# EAGLE schematic I2CHubLogicLevel (EAGLE 8.4.0)
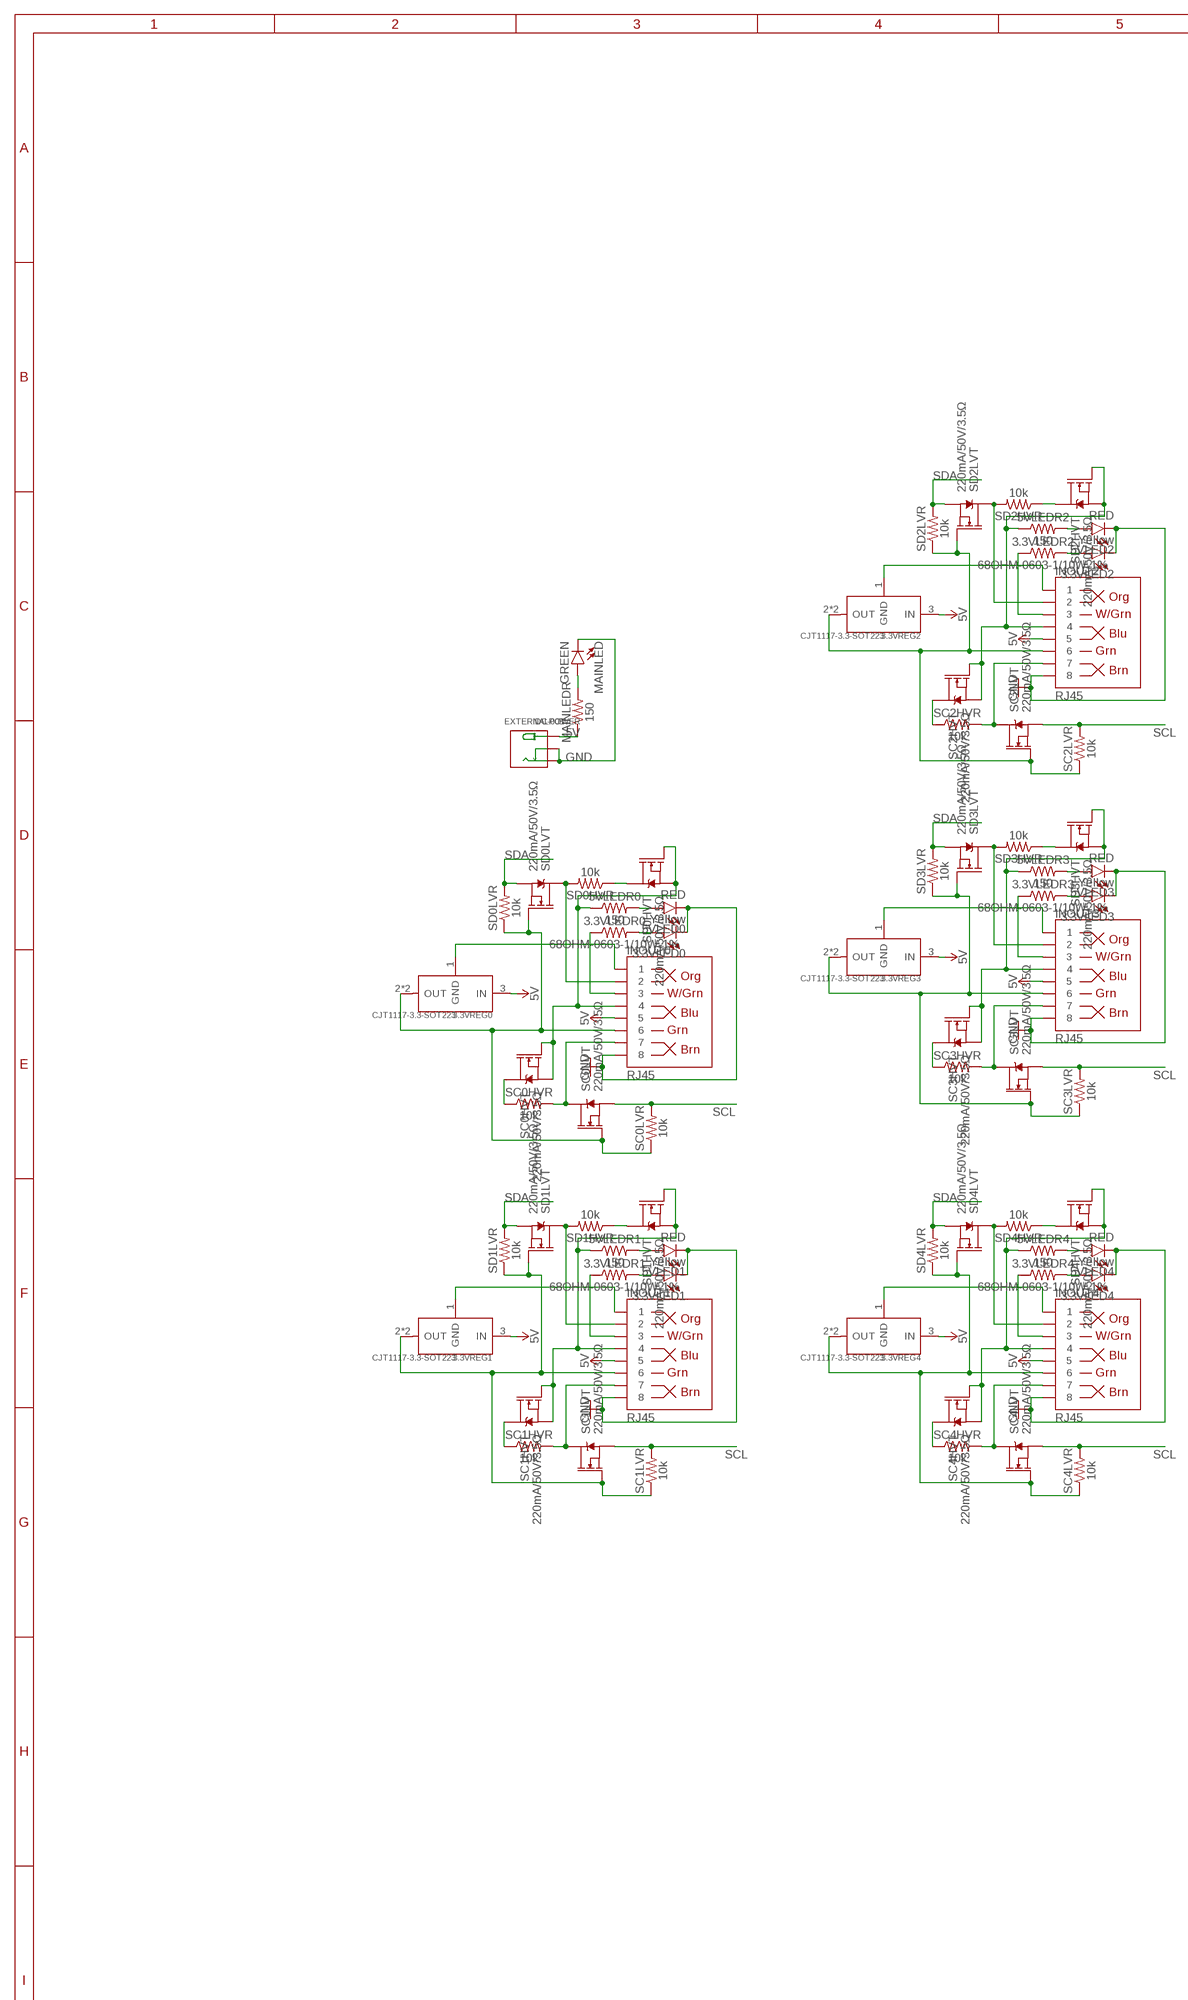
[diagram p0: schematic, sheet 1, part 1 of 2]
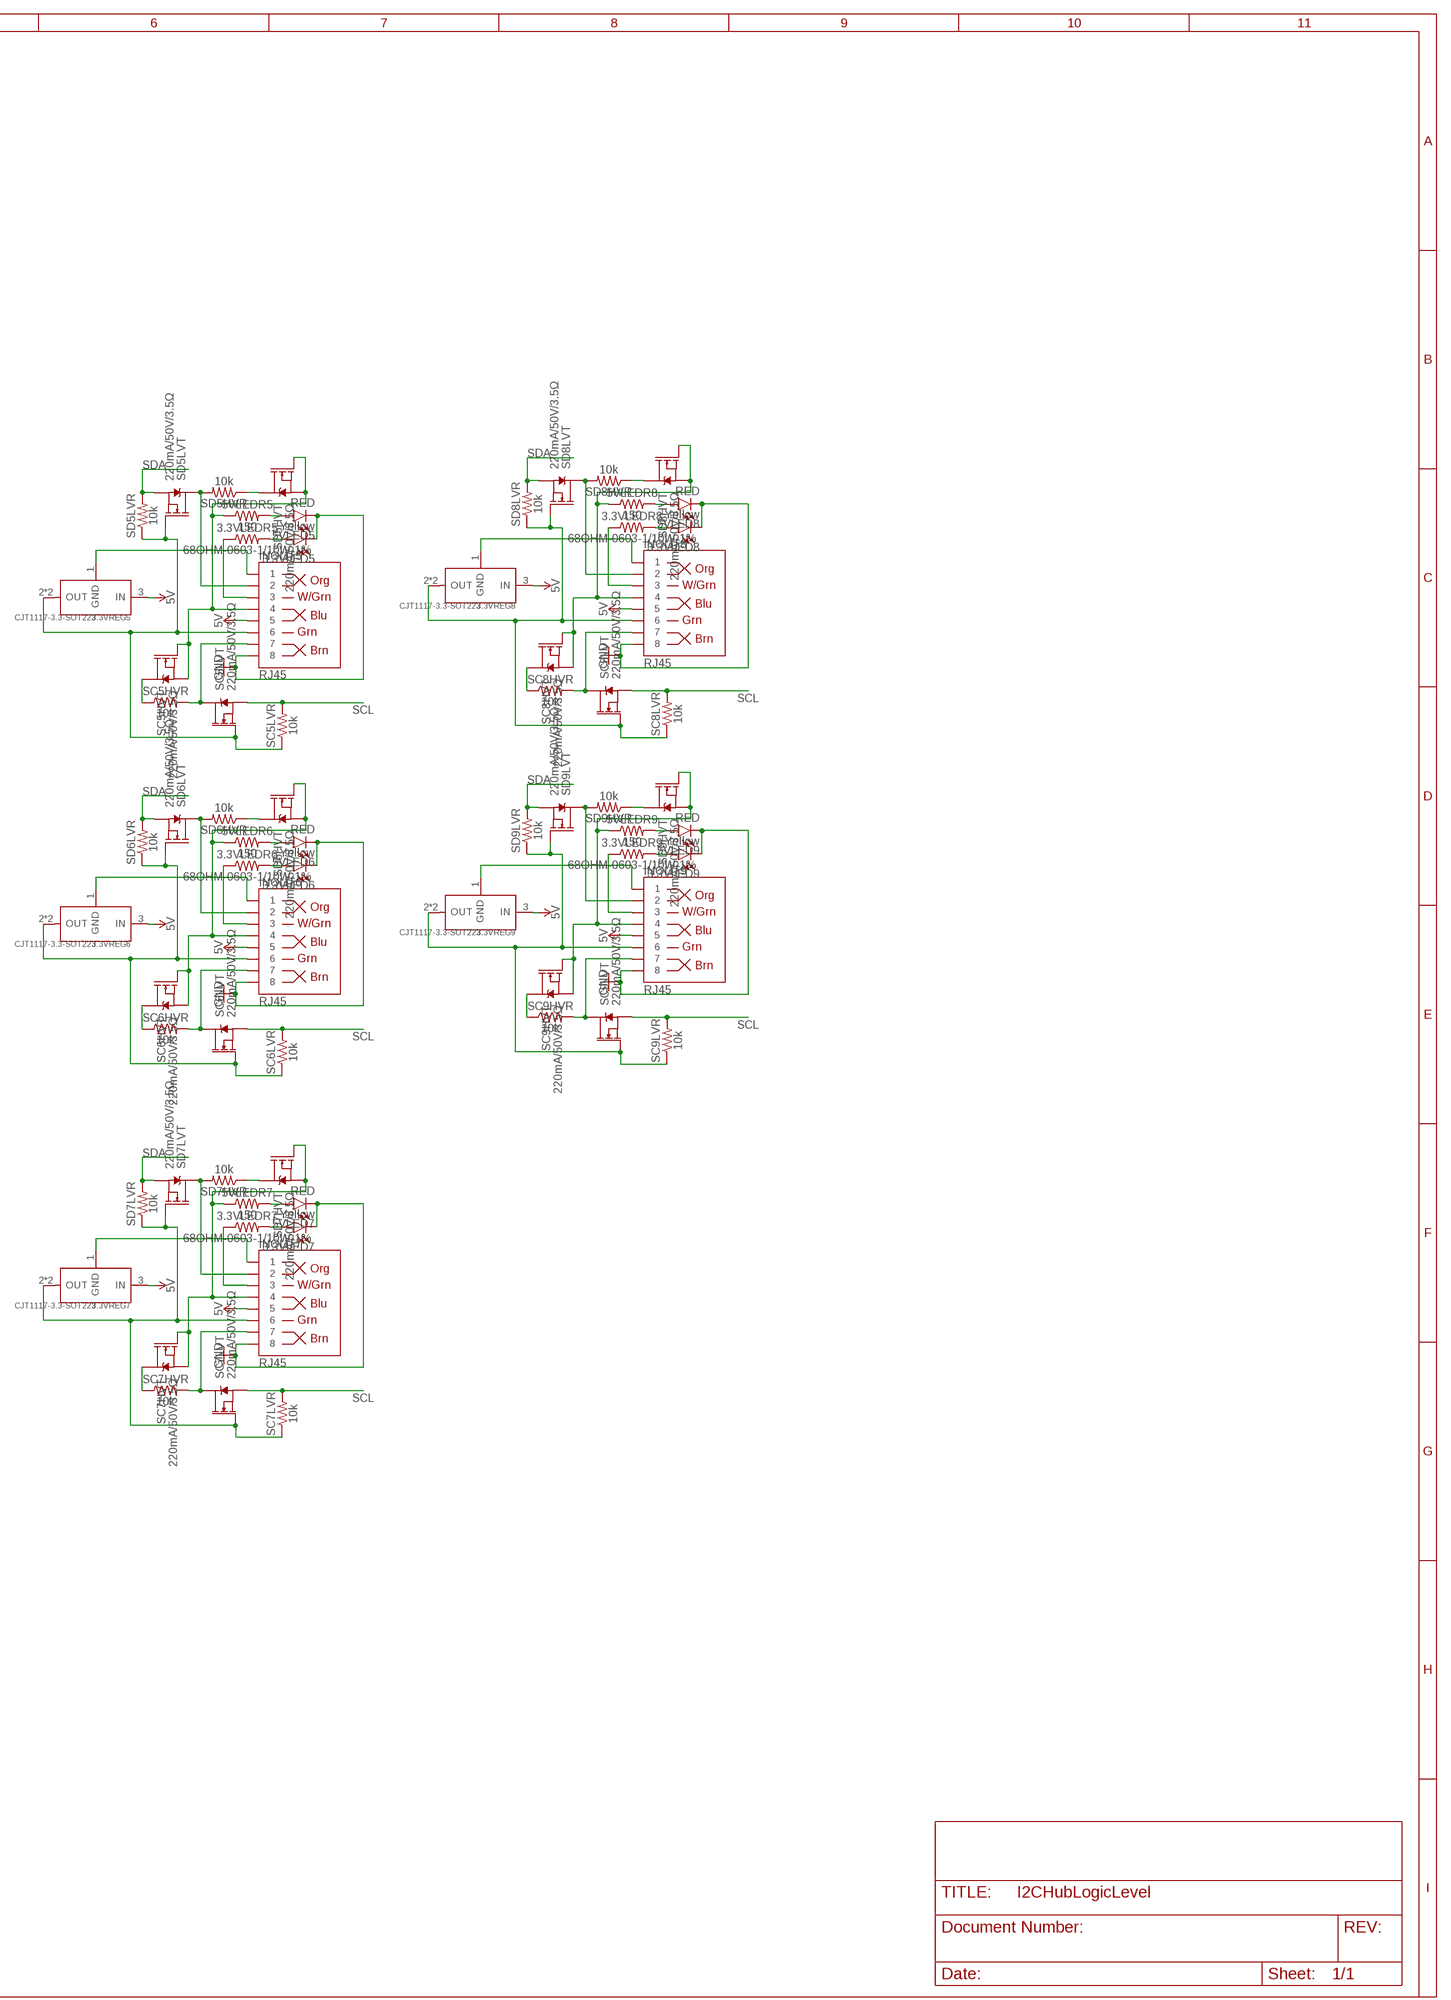
[diagram p1: schematic, sheet 1, part 2 of 2]

## Parts
3.3VLED0  Yellow  LED-YELLOW0603  [LED-0603]
3.3VLED1  Yellow  LED-YELLOW0603  [LED-0603]
3.3VLED2  Yellow  LED-YELLOW0603  [LED-0603]
3.3VLED3  Yellow  LED-YELLOW0603  [LED-0603]
3.3VLED4  Yellow  LED-YELLOW0603  [LED-0603]
3.3VLED5  Yellow  LED-YELLOW0603  [LED-0603]
3.3VLED6  Yellow  LED-YELLOW0603  [LED-0603]
3.3VLED7  Yellow  LED-YELLOW0603  [LED-0603]
3.3VLED8  Yellow  LED-YELLOW0603  [LED-0603]
3.3VLED9  Yellow  LED-YELLOW0603  [LED-0603]
3.3VLEDR0  68OHM-0603-1/10W-1%  [0603]
3.3VLEDR1  68OHM-0603-1/10W-1%  [0603]
3.3VLEDR2  68OHM-0603-1/10W-1%  [0603]
3.3VLEDR3  68OHM-0603-1/10W-1%  [0603]
3.3VLEDR4  68OHM-0603-1/10W-1%  [0603]
3.3VLEDR5  68OHM-0603-1/10W-1%  [0603]
3.3VLEDR6  68OHM-0603-1/10W-1%  [0603]
3.3VLEDR7  68OHM-0603-1/10W-1%  [0603]
3.3VLEDR8  68OHM-0603-1/10W-1%  [0603]
3.3VLEDR9  68OHM-0603-1/10W-1%  [0603]
3.3VREG0  CJT1117-3.3-SOT223  PMIC-CJT1117-3.3(SOT223)  [SOT-223]
3.3VREG1  CJT1117-3.3-SOT223  PMIC-CJT1117-3.3(SOT223)  [SOT-223]
3.3VREG2  CJT1117-3.3-SOT223  PMIC-CJT1117-3.3(SOT223)  [SOT-223]
3.3VREG3  CJT1117-3.3-SOT223  PMIC-CJT1117-3.3(SOT223)  [SOT-223]
3.3VREG4  CJT1117-3.3-SOT223  PMIC-CJT1117-3.3(SOT223)  [SOT-223]
3.3VREG5  CJT1117-3.3-SOT223  PMIC-CJT1117-3.3(SOT223)  [SOT-223]
3.3VREG6  CJT1117-3.3-SOT223  PMIC-CJT1117-3.3(SOT223)  [SOT-223]
3.3VREG7  CJT1117-3.3-SOT223  PMIC-CJT1117-3.3(SOT223)  [SOT-223]
3.3VREG8  CJT1117-3.3-SOT223  PMIC-CJT1117-3.3(SOT223)  [SOT-223]
3.3VREG9  CJT1117-3.3-SOT223  PMIC-CJT1117-3.3(SOT223)  [SOT-223]
5VLED0  RED  LED-RED0603  [LED-0603]
5VLED1  RED  LED-RED0603  [LED-0603]
5VLED2  RED  LED-RED0603  [LED-0603]
5VLED3  RED  LED-RED0603  [LED-0603]
5VLED4  RED  LED-RED0603  [LED-0603]
5VLED5  RED  LED-RED0603  [LED-0603]
5VLED6  RED  LED-RED0603  [LED-0603]
5VLED7  RED  LED-RED0603  [LED-0603]
5VLED8  RED  LED-RED0603  [LED-0603]
5VLED9  RED  LED-RED0603  [LED-0603]
5VLEDR0  150  150OHM-0603-1/10W-1%  [0603]
5VLEDR1  150  150OHM-0603-1/10W-1%  [0603]
5VLEDR2  150  150OHM-0603-1/10W-1%  [0603]
5VLEDR3  150  150OHM-0603-1/10W-1%  [0603]
5VLEDR4  150  150OHM-0603-1/10W-1%  [0603]
5VLEDR5  150  150OHM-0603-1/10W-1%  [0603]
5VLEDR6  150  150OHM-0603-1/10W-1%  [0603]
5VLEDR7  150  150OHM-0603-1/10W-1%  [0603]
5VLEDR8  150  150OHM-0603-1/10W-1%  [0603]
5VLEDR9  150  150OHM-0603-1/10W-1%  [0603]
EXTERNALPOWER  DC-005  CONN-POWER-JACK-2.1MM(DC-005)  [DCJ3P-14.2X11.0X9.0MM]
INOUT0  RJ45  RJ45-8  [RJ45-8]
INOUT1  RJ45  RJ45-8  [RJ45-8]
INOUT2  RJ45  RJ45-8  [RJ45-8]
INOUT3  RJ45  RJ45-8  [RJ45-8]
INOUT4  RJ45  RJ45-8  [RJ45-8]
INOUT5  RJ45  RJ45-8  [RJ45-8]
INOUT6  RJ45  RJ45-8  [RJ45-8]
INOUT7  RJ45  RJ45-8  [RJ45-8]
INOUT8  RJ45  RJ45-8  [RJ45-8]
INOUT9  RJ45  RJ45-8  [RJ45-8]
MAINLED  GREEN  LED-GREEN0603  [LED-0603]
MAINLEDR  150  150OHM-0603-1/10W-1%  [0603]
SC0HVR  10k  10KOHM-0603-1/10W-1%  [0603]
SC0HVT  220mA/50V/3.5Ω  MOSFET-NCH-BSS138  [SOT23-3]
SC0LVR  10k  10KOHM-0603-1/10W-1%  [0603]
SC0LVT  220mA/50V/3.5Ω  MOSFET-NCH-BSS138  [SOT23-3]
SC1HVR  10k  10KOHM-0603-1/10W-1%  [0603]
SC1HVT  220mA/50V/3.5Ω  MOSFET-NCH-BSS138  [SOT23-3]
SC1LVR  10k  10KOHM-0603-1/10W-1%  [0603]
SC1LVT  220mA/50V/3.5Ω  MOSFET-NCH-BSS138  [SOT23-3]
SC2HVR  10k  10KOHM-0603-1/10W-1%  [0603]
SC2HVT  220mA/50V/3.5Ω  MOSFET-NCH-BSS138  [SOT23-3]
SC2LVR  10k  10KOHM-0603-1/10W-1%  [0603]
SC2LVT  220mA/50V/3.5Ω  MOSFET-NCH-BSS138  [SOT23-3]
SC3HVR  10k  10KOHM-0603-1/10W-1%  [0603]
SC3HVT  220mA/50V/3.5Ω  MOSFET-NCH-BSS138  [SOT23-3]
SC3LVR  10k  10KOHM-0603-1/10W-1%  [0603]
SC3LVT  220mA/50V/3.5Ω  MOSFET-NCH-BSS138  [SOT23-3]
SC4HVR  10k  10KOHM-0603-1/10W-1%  [0603]
SC4HVT  220mA/50V/3.5Ω  MOSFET-NCH-BSS138  [SOT23-3]
SC4LVR  10k  10KOHM-0603-1/10W-1%  [0603]
SC4LVT  220mA/50V/3.5Ω  MOSFET-NCH-BSS138  [SOT23-3]
SC5HVR  10k  10KOHM-0603-1/10W-1%  [0603]
SC5HVT  220mA/50V/3.5Ω  MOSFET-NCH-BSS138  [SOT23-3]
SC5LVR  10k  10KOHM-0603-1/10W-1%  [0603]
SC5LVT  220mA/50V/3.5Ω  MOSFET-NCH-BSS138  [SOT23-3]
SC6HVR  10k  10KOHM-0603-1/10W-1%  [0603]
SC6HVT  220mA/50V/3.5Ω  MOSFET-NCH-BSS138  [SOT23-3]
SC6LVR  10k  10KOHM-0603-1/10W-1%  [0603]
SC6LVT  220mA/50V/3.5Ω  MOSFET-NCH-BSS138  [SOT23-3]
SC7HVR  10k  10KOHM-0603-1/10W-1%  [0603]
SC7HVT  220mA/50V/3.5Ω  MOSFET-NCH-BSS138  [SOT23-3]
SC7LVR  10k  10KOHM-0603-1/10W-1%  [0603]
SC7LVT  220mA/50V/3.5Ω  MOSFET-NCH-BSS138  [SOT23-3]
SC8HVR  10k  10KOHM-0603-1/10W-1%  [0603]
SC8HVT  220mA/50V/3.5Ω  MOSFET-NCH-BSS138  [SOT23-3]
SC8LVR  10k  10KOHM-0603-1/10W-1%  [0603]
SC8LVT  220mA/50V/3.5Ω  MOSFET-NCH-BSS138  [SOT23-3]
SC9HVR  10k  10KOHM-0603-1/10W-1%  [0603]
SC9HVT  220mA/50V/3.5Ω  MOSFET-NCH-BSS138  [SOT23-3]
SC9LVR  10k  10KOHM-0603-1/10W-1%  [0603]
SC9LVT  220mA/50V/3.5Ω  MOSFET-NCH-BSS138  [SOT23-3]
SD0HVR  10k  10KOHM-0603-1/10W-1%  [0603]
SD0HVT  220mA/50V/3.5Ω  MOSFET-NCH-BSS138  [SOT23-3]
SD0LVR  10k  10KOHM-0603-1/10W-1%  [0603]
SD0LVT  220mA/50V/3.5Ω  MOSFET-NCH-BSS138  [SOT23-3]
SD1HVR  10k  10KOHM-0603-1/10W-1%  [0603]
SD1HVT  220mA/50V/3.5Ω  MOSFET-NCH-BSS138  [SOT23-3]
SD1LVR  10k  10KOHM-0603-1/10W-1%  [0603]
SD1LVT  220mA/50V/3.5Ω  MOSFET-NCH-BSS138  [SOT23-3]
SD2HVR  10k  10KOHM-0603-1/10W-1%  [0603]
SD2HVT  220mA/50V/3.5Ω  MOSFET-NCH-BSS138  [SOT23-3]
SD2LVR  10k  10KOHM-0603-1/10W-1%  [0603]
SD2LVT  220mA/50V/3.5Ω  MOSFET-NCH-BSS138  [SOT23-3]
SD3HVR  10k  10KOHM-0603-1/10W-1%  [0603]
SD3HVT  220mA/50V/3.5Ω  MOSFET-NCH-BSS138  [SOT23-3]
SD3LVR  10k  10KOHM-0603-1/10W-1%  [0603]
SD3LVT  220mA/50V/3.5Ω  MOSFET-NCH-BSS138  [SOT23-3]
SD4HVR  10k  10KOHM-0603-1/10W-1%  [0603]
SD4HVT  220mA/50V/3.5Ω  MOSFET-NCH-BSS138  [SOT23-3]
SD4LVR  10k  10KOHM-0603-1/10W-1%  [0603]
SD4LVT  220mA/50V/3.5Ω  MOSFET-NCH-BSS138  [SOT23-3]
SD5HVR  10k  10KOHM-0603-1/10W-1%  [0603]
SD5HVT  220mA/50V/3.5Ω  MOSFET-NCH-BSS138  [SOT23-3]
SD5LVR  10k  10KOHM-0603-1/10W-1%  [0603]
SD5LVT  220mA/50V/3.5Ω  MOSFET-NCH-BSS138  [SOT23-3]
SD6HVR  10k  10KOHM-0603-1/10W-1%  [0603]
SD6HVT  220mA/50V/3.5Ω  MOSFET-NCH-BSS138  [SOT23-3]
SD6LVR  10k  10KOHM-0603-1/10W-1%  [0603]
SD6LVT  220mA/50V/3.5Ω  MOSFET-NCH-BSS138  [SOT23-3]
SD7HVR  10k  10KOHM-0603-1/10W-1%  [0603]
SD7HVT  220mA/50V/3.5Ω  MOSFET-NCH-BSS138  [SOT23-3]
SD7LVR  10k  10KOHM-0603-1/10W-1%  [0603]
SD7LVT  220mA/50V/3.5Ω  MOSFET-NCH-BSS138  [SOT23-3]
SD8HVR  10k  10KOHM-0603-1/10W-1%  [0603]
SD8HVT  220mA/50V/3.5Ω  MOSFET-NCH-BSS138  [SOT23-3]
SD8LVR  10k  10KOHM-0603-1/10W-1%  [0603]
SD8LVT  220mA/50V/3.5Ω  MOSFET-NCH-BSS138  [SOT23-3]
SD9HVR  10k  10KOHM-0603-1/10W-1%  [0603]
SD9HVT  220mA/50V/3.5Ω  MOSFET-NCH-BSS138  [SOT23-3]
SD9LVR  10k  10KOHM-0603-1/10W-1%  [0603]
SD9LVT  220mA/50V/3.5Ω  MOSFET-NCH-BSS138  [SOT23-3]

## Nets
3.3CC0: 3.3VLEDR0.1 INOUT0.3
3.3CC1: 3.3VLEDR1.1 INOUT1.3
3.3CC2: 3.3VLEDR2.1 INOUT2.3
3.3CC3: 3.3VLEDR3.1 INOUT3.3
3.3CC4: 3.3VLEDR4.1 INOUT4.3
3.3CC5: 3.3VLEDR5.1 INOUT5.3
3.3CC6: 3.3VLEDR6.1 INOUT6.3
3.3CC7: 3.3VLEDR7.1 INOUT7.3
3.3CC8: 3.3VLEDR8.1 INOUT8.3
3.3CC9: 3.3VLEDR9.1 INOUT9.3
3.3LED0: 3.3VLED0.A 3.3VLEDR0.2
3.3LED1: 3.3VLED1.A 3.3VLEDR1.2
3.3LED2: 3.3VLED2.A 3.3VLEDR2.2
3.3LED3: 3.3VLED3.A 3.3VLEDR3.2
3.3LED4: 3.3VLED4.A 3.3VLEDR4.2
3.3LED5: 3.3VLED5.A 3.3VLEDR5.2
3.3LED6: 3.3VLED6.A 3.3VLEDR6.2
3.3LED7: 3.3VLED7.A 3.3VLEDR7.2
3.3LED8: 3.3VLED8.A 3.3VLEDR8.2
3.3LED9: 3.3VLED9.A 3.3VLEDR9.2
3.3V0: 3.3VREG0.2(OUT) 3.3VREG0.TER(OUT) INOUT0.6 SC0LVR.1 SC0LVT.1(G) SD0LVR.1 SD0LVT.1(G)
3.3V1: 3.3VREG1.2(OUT) 3.3VREG1.TER(OUT) INOUT1.6 SC1LVR.1 SC1LVT.1(G) SD1LVR.1 SD1LVT.1(G)
3.3V2: 3.3VREG2.2(OUT) 3.3VREG2.TER(OUT) INOUT2.6 SC2LVR.1 SC2LVT.1(G) SD2LVR.1 SD2LVT.1(G)
3.3V3: 3.3VREG3.2(OUT) 3.3VREG3.TER(OUT) INOUT3.6 SC3LVR.1 SC3LVT.1(G) SD3LVR.1 SD3LVT.1(G)
3.3V4: 3.3VREG4.2(OUT) 3.3VREG4.TER(OUT) INOUT4.6 SC4LVR.1 SC4LVT.1(G) SD4LVR.1 SD4LVT.1(G)
3.3V5: 3.3VREG5.2(OUT) 3.3VREG5.TER(OUT) INOUT5.6 SC5LVR.1 SC5LVT.1(G) SD5LVR.1 SD5LVT.1(G)
3.3V6: 3.3VREG6.2(OUT) 3.3VREG6.TER(OUT) INOUT6.6 SC6LVR.1 SC6LVT.1(G) SD6LVR.1 SD6LVT.1(G)
3.3V7: 3.3VREG7.2(OUT) 3.3VREG7.TER(OUT) INOUT7.6 SC7LVR.1 SC7LVT.1(G) SD7LVR.1 SD7LVT.1(G)
3.3V8: 3.3VREG8.2(OUT) 3.3VREG8.TER(OUT) INOUT8.6 SC8LVR.1 SC8LVT.1(G) SD8LVR.1 SD8LVT.1(G)
3.3V9: 3.3VREG9.2(OUT) 3.3VREG9.TER(OUT) INOUT9.6 SC9LVR.1 SC9LVT.1(G) SD9LVR.1 SD9LVT.1(G)
5V: 3.3VREG0.3(IN) 3.3VREG1.3(IN) 3.3VREG2.3(IN) 3.3VREG3.3(IN) 3.3VREG4.3(IN) 3.3VREG5.3(IN) 3.3VREG6.3(IN) 3.3VREG7.3(IN) 3.3VREG8.3(IN) 3.3VREG9.3(IN) EXTERNALPOWER.+ INOUT0.5 INOUT1.5 INOUT2.5 INOUT3.5 INOUT4.5 INOUT5.5 INOUT6.5 INOUT7.5 INOUT8.5 INOUT9.5 MAINLEDR.1
5VCC0: 5VLEDR0.1 INOUT0.4 SC0HVT.1(G) SC0HVT.2(S) SD0HVT.1(G) SD0HVT.2(S)
5VCC1: 5VLEDR1.1 INOUT1.4 SC1HVT.1(G) SC1HVT.2(S) SD1HVT.1(G) SD1HVT.2(S)
5VCC2: 5VLEDR2.1 INOUT2.4 SC2HVT.1(G) SC2HVT.2(S) SD2HVT.1(G) SD2HVT.2(S)
5VCC3: 5VLEDR3.1 INOUT3.4 SC3HVT.1(G) SC3HVT.2(S) SD3HVT.1(G) SD3HVT.2(S)
5VCC4: 5VLEDR4.1 INOUT4.4 SC4HVT.1(G) SC4HVT.2(S) SD4HVT.1(G) SD4HVT.2(S)
5VCC5: 5VLEDR5.1 INOUT5.4 SC5HVT.1(G) SC5HVT.2(S) SD5HVT.1(G) SD5HVT.2(S)
5VCC6: 5VLEDR6.1 INOUT6.4 SC6HVT.1(G) SC6HVT.2(S) SD6HVT.1(G) SD6HVT.2(S)
5VCC7: 5VLEDR7.1 INOUT7.4 SC7HVT.1(G) SC7HVT.2(S) SD7HVT.1(G) SD7HVT.2(S)
5VCC8: 5VLEDR8.1 INOUT8.4 SC8HVT.1(G) SC8HVT.2(S) SD8HVT.1(G) SD8HVT.2(S)
5VCC9: 5VLEDR9.1 INOUT9.4 SC9HVT.1(G) SC9HVT.2(S) SD9HVT.1(G) SD9HVT.2(S)
5VLED0: 5VLED0.A 5VLEDR0.2
5VLED1: 5VLED1.A 5VLEDR1.2
5VLED2: 5VLED2.A 5VLEDR2.2
5VLED3: 5VLED3.A 5VLEDR3.2
5VLED4: 5VLED4.A 5VLEDR4.2
5VLED5: 5VLED5.A 5VLEDR5.2
5VLED6: 5VLED6.A 5VLEDR6.2
5VLED7: 5VLED7.A 5VLEDR7.2
5VLED8: 5VLED8.A 5VLEDR8.2
5VLED9: 5VLED9.A 5VLEDR9.2
GND: 3.3VLED0.C 3.3VLED1.C 3.3VLED2.C 3.3VLED3.C 3.3VLED4.C 3.3VLED5.C 3.3VLED6.C 3.3VLED7.C 3.3VLED8.C 3.3VLED9.C 5VLED0.C 5VLED1.C 5VLED2.C 5VLED3.C 5VLED4.C 5VLED5.C 5VLED6.C 5VLED7.C 5VLED8.C 5VLED9.C EXTERNALPOWER.-1(-) EXTERNALPOWER.-2(CDN) INOUT0.8 INOUT1.8 INOUT2.8 INOUT3.8 INOUT4.8 INOUT5.8 INOUT6.8 INOUT7.8 INOUT8.8 INOUT9.8 MAINLED.C
GNDCC0: 3.3VREG0.1(GND) INOUT0.1
GNDCC1: 3.3VREG1.1(GND) INOUT1.1
GNDCC2: 3.3VREG2.1(GND) INOUT2.1
GNDCC3: 3.3VREG3.1(GND) INOUT3.1
GNDCC4: 3.3VREG4.1(GND) INOUT4.1
GNDCC5: 3.3VREG5.1(GND) INOUT5.1
GNDCC6: 3.3VREG6.1(GND) INOUT6.1
GNDCC7: 3.3VREG7.1(GND) INOUT7.1
GNDCC8: 3.3VREG8.1(GND) INOUT8.1
GNDCC9: 3.3VREG9.1(GND) INOUT9.1
MAINLED: MAINLED.A MAINLEDR.2
SC0: INOUT0.7 SC0HVR.2 SC0LVT.3(D)
SC1: INOUT1.7 SC1HVR.2 SC1LVT.3(D)
SC2: INOUT2.7 SC2HVR.2 SC2LVT.3(D)
SC3: INOUT3.7 SC3HVR.2 SC3LVT.3(D)
SC4: INOUT4.7 SC4HVR.2 SC4LVT.3(D)
SC5: INOUT5.7 SC5HVR.2 SC5LVT.3(D)
SC6: INOUT6.7 SC6HVR.2 SC6LVT.3(D)
SC7: INOUT7.7 SC7HVR.2 SC7LVT.3(D)
SC8: INOUT8.7 SC8HVR.2 SC8LVT.3(D)
SC9: INOUT9.7 SC9HVR.2 SC9LVT.3(D)
SCHV0: SC0HVR.1 SC0HVT.3(D)
SCHV1: SC1HVR.1 SC1HVT.3(D)
SCHV2: SC2HVR.1 SC2HVT.3(D)
SCHV3: SC3HVR.1 SC3HVT.3(D)
SCHV4: SC4HVR.1 SC4HVT.3(D)
SCHV5: SC5HVR.1 SC5HVT.3(D)
SCHV6: SC6HVR.1 SC6HVT.3(D)
SCHV7: SC7HVR.1 SC7HVT.3(D)
SCHV8: SC8HVR.1 SC8HVT.3(D)
SCHV9: SC9HVR.1 SC9HVT.3(D)
SCL: SC0LVR.2 SC0LVT.2(S) SC1LVR.2 SC1LVT.2(S) SC2LVR.2 SC2LVT.2(S) SC3LVR.2 SC3LVT.2(S) SC4LVR.2 SC4LVT.2(S) SC5LVR.2 SC5LVT.2(S) SC6LVR.2 SC6LVT.2(S) SC7LVR.2 SC7LVT.2(S) SC8LVR.2 SC8LVT.2(S) SC9LVR.2 SC9LVT.2(S)
SD0: INOUT0.2 SD0HVR.2 SD0LVT.3(D)
SD1: INOUT1.2 SD1HVR.2 SD1LVT.3(D)
SD2: INOUT2.2 SD2HVR.2 SD2LVT.3(D)
SD3: INOUT3.2 SD3HVR.2 SD3LVT.3(D)
SD4: INOUT4.2 SD4HVR.2 SD4LVT.3(D)
SD5: INOUT5.2 SD5HVR.2 SD5LVT.3(D)
SD6: INOUT6.2 SD6HVR.2 SD6LVT.3(D)
SD7: INOUT7.2 SD7HVR.2 SD7LVT.3(D)
SD8: INOUT8.2 SD8HVR.2 SD8LVT.3(D)
SD9: INOUT9.2 SD9HVR.2 SD9LVT.3(D)
SDA: SD0LVR.2 SD0LVT.2(S) SD1LVR.2 SD1LVT.2(S) SD2LVR.2 SD2LVT.2(S) SD3LVR.2 SD3LVT.2(S) SD4LVR.2 SD4LVT.2(S) SD5LVR.2 SD5LVT.2(S) SD6LVR.2 SD6LVT.2(S) SD7LVR.2 SD7LVT.2(S) SD8LVR.2 SD8LVT.2(S) SD9LVR.2 SD9LVT.2(S)
SDHV0: SD0HVR.1 SD0HVT.3(D)
SDHV1: SD1HVR.1 SD1HVT.3(D)
SDHV2: SD2HVR.1 SD2HVT.3(D)
SDHV3: SD3HVR.1 SD3HVT.3(D)
SDHV4: SD4HVR.1 SD4HVT.3(D)
SDHV5: SD5HVR.1 SD5HVT.3(D)
SDHV6: SD6HVR.1 SD6HVT.3(D)
SDHV7: SD7HVR.1 SD7HVT.3(D)
SDHV8: SD8HVR.1 SD8HVT.3(D)
SDHV9: SD9HVR.1 SD9HVT.3(D)

## Library data of the parts
3.3VLED0 3.3VLED1-3.3VLED9 = SparkFun-LED:LED-YELLOW: Yellow SMD LED Used in manufacturing several products at SparkFun. Packages: 0603 - SMD 0603 package[Product Link] <http://www.kingbrightusa.com/product.asp?catalog_name=LED&product_id=APT1608SYCK> 0603 -SMART - SMART SMD 0603 package (more efficient/more expensive) [Product Link] <http://www.osram-os.com/osram_os/en/products/product-catalog/led-light-emitting-diodes/smartled-0603/ly-l29k/index.jsp> LilyPad - SMD1206 package[Product Datasheet] <https://www.sparkfun.com/datasheets/DevTools/LilyPad/Q150YUS4.pdf> SparkFun Products: Blynk Board <https://www.sparkfun.com/products/13794> IOIO-OTG <https://www.sparkfun.com/products/13613> XBee Explorer Serial <https://www.sparkfun.com/products/13225>; PROD_ID: DIO-09003
3.3VLEDR0 3.3VLEDR1-3.3VLEDR9 = SparkFun-Resistors:68OHM: 68Ω resistor A resistor is a passive two-terminal electrical component that implements electrical resistance as a circuit element. Resistors act to reduce current flow, and, at the same time, act to lower voltage levels within circuits. - Wikipedia
3.3VREG0 3.3VREG1-3.3VREG9 = Seeed-IC:PMIC-CJT1117-3.3(SOT223): 310030097; MPN: CJT1117-3.3
5VLED0 5VLED1-5VLED9 = SparkFun-LED:LED-RED: Red SMD LED Used in manufacturing of most products at SparkFun Packages: 0603 - SMD 0603 package [Product Link] <http://docs.avagotech.com/docs/AV02-0551EN> 0603 SMART - SMD 0603 SMART package ( more efficient and expensive)[Product Link] <http://www.osram-os.com/Graphics/XPic2/00077099_0.pdf> 1206 - SMD1206 package [Product Link] <https://www.sparkfun.com/datasheets/DevTools/LilyPad/Q150OVS4.pdff> SparkFun Products: Pro Mini 328 -5V <https://www.sparkfun.com/products/821> RedBoard <https://www.sparkfun.com/products/12757> IOIO-OTG <https://www.sparkfun.com/products/13613>; PROD_ID: DIO-00819
5VLEDR0 5VLEDR1-5VLEDR9 MAINLEDR = SparkFun-Resistors:150OHM: 150Ω resistor A resistor is a passive two-terminal electrical component that implements electrical resistance as a circuit element. Resistors act to reduce current flow, and, at the same time, act to lower voltage levels within circuits. - Wikipedia; PROD_ID: RES-11028
EXTERNALPOWER = Seeed-Connector:CONN-POWER-JACK-2.1MM(DC-005): 320120003; MPN: DC-005
INOUT0 INOUT1-INOUT9 = SparkFun-Connectors:RJ45-8: RJ45 Jack - 8 pin Simple RJ45, 8-pin connection. Commonly used for Cat5, Cat5e, and Cat6 Ethernet cables. Here is the connector we sell at SparkFun: RJ45 8-Pin Connector <https://www.sparkfun.com/products/643> (PRT-00643) Datasheet <https://cdn.sparkfun.com/datasheets/Prototyping/04908.pdf> It is used on this SparkFun product: SparkFun RJ45 Breakout <https://www.sparkfun.com/products/716> (BOB-00716) Note, you may also be interested in the "MAGJACK" version of this. It is basically a RJ45 connector, but also has some status LEDs built into the connector housing. You can check that out in this library at the device named "MAGJACK.dev" and see these products online: RJ45 Ethernet MagJack-Compatible <https://www.sparkfun.com/products/8534> (PRT-08534) SparkFun RJ45 MagJack Breakout <https://www.sparkfun.com/products/13021> (BOB-13021); PROD_ID: CONN-08506; SF_ID: PRT-00643
MAINLED = SparkFun-LED:LED-GREEN: Green SMD LED Used in manufacturing of various products at SparkFun Packages: 0603 - SMD 0603 package [Product Link] <http://www.futureelectronics.com/en/technologies/semiconductors/optoelectronics/leds/Pages/9894312-LTST-C190GKT.aspx?CrossPart=HSMG-C190&IM=0> LilyPad 1206 - SMD1206 LilyPad package [Product Link] <http://www.futureelectronics.com/en/Technologies/Product.aspx?ProductID=IN150NGHARVATEKCORPORATION2049943&IM=0> 1206 - SMD1206 package [Product Link] <http://www.futureelectronics.com/en/technologies/semiconductors/optoelectronics/leds/Pages/8315665-LTST-C150KGKT.aspx?IM=0> 1206 Bottom Mount -SMD 1206 Bottom Mount [Product Link] <http://www.digikey.com/product-detail/en/lite-on-inc/LTST-C230KGKT/160-1456-1-ND/386854> SparkFun Products: Pro Mini 328 -5V <https://www.sparkfun.com/products/821> RedBoard <https://www.sparkfun.com/products/12757> MP3 Trigger <https://www.sparkfun.com/products/13720> Makey Makey <https://www.sparkfun.com/products/11076>; PROD_ID: DIO-00821
SC0HVR SC0LVR SC1HVR SC1LVR SC2HVR SC2LVR SC3HVR SC3LVR SC4HVR SC4LVR SC5HVR SC5LVR SC6HVR SC6LVR SC7HVR SC7LVR SC8HVR SC8LVR SC9HVR SC9LVR SD0HVR SD0LVR SD1HVR SD1LVR SD2HVR SD2LVR SD3HVR SD3LVR SD4HVR SD4LVR SD5HVR SD5LVR SD6HVR SD6LVR SD7HVR SD7LVR SD8HVR SD8LVR SD9HVR SD9LVR = SparkFun-Resistors:10KOHM: 10kΩ resistor A resistor is a passive two-terminal electrical component that implements electrical resistance as a circuit element. Resistors act to reduce current flow, and, at the same time, act to lower voltage levels within circuits. - Wikipedia; PROD_ID: RES-00824
SC0HVT SC0LVT SC1HVT SC1LVT SC2HVT SC2LVT SC3HVT SC3LVT SC4HVT SC4LVT SC5HVT SC5LVT SC6HVT SC6LVT SC7HVT SC7LVT SC8HVT SC8LVT SC9HVT SC9LVT SD0HVT SD0LVT SD1HVT SD1LVT SD2HVT SD2LVT SD3HVT SD3LVT SD4HVT SD4LVT SD5HVT SD5LVT SD6HVT SD6LVT SD7HVT SD7LVT SD8HVT SD8LVT SD9HVT SD9LVT = SparkFun-DiscreteSemi:MOSFET-NCH: N-channel MOSFETs Voltage controlled devices that allow control of high current outputs. SparkFun Products: SparkFun OpenScale <https://www.sparkfun.com/products/13261> SparkFun Digital Sandbox <https://www.sparkfun.com/products/12651> SparkFun Monster Moto Shield <https://www.sparkfun.com/products/10182> SparkFun MOSFET Power Controller <https://www.sparkfun.com/products/11214>; PROD_ID: TRANS-00830